# EAGLE design big-module-shift (EAGLE 6.5.0)
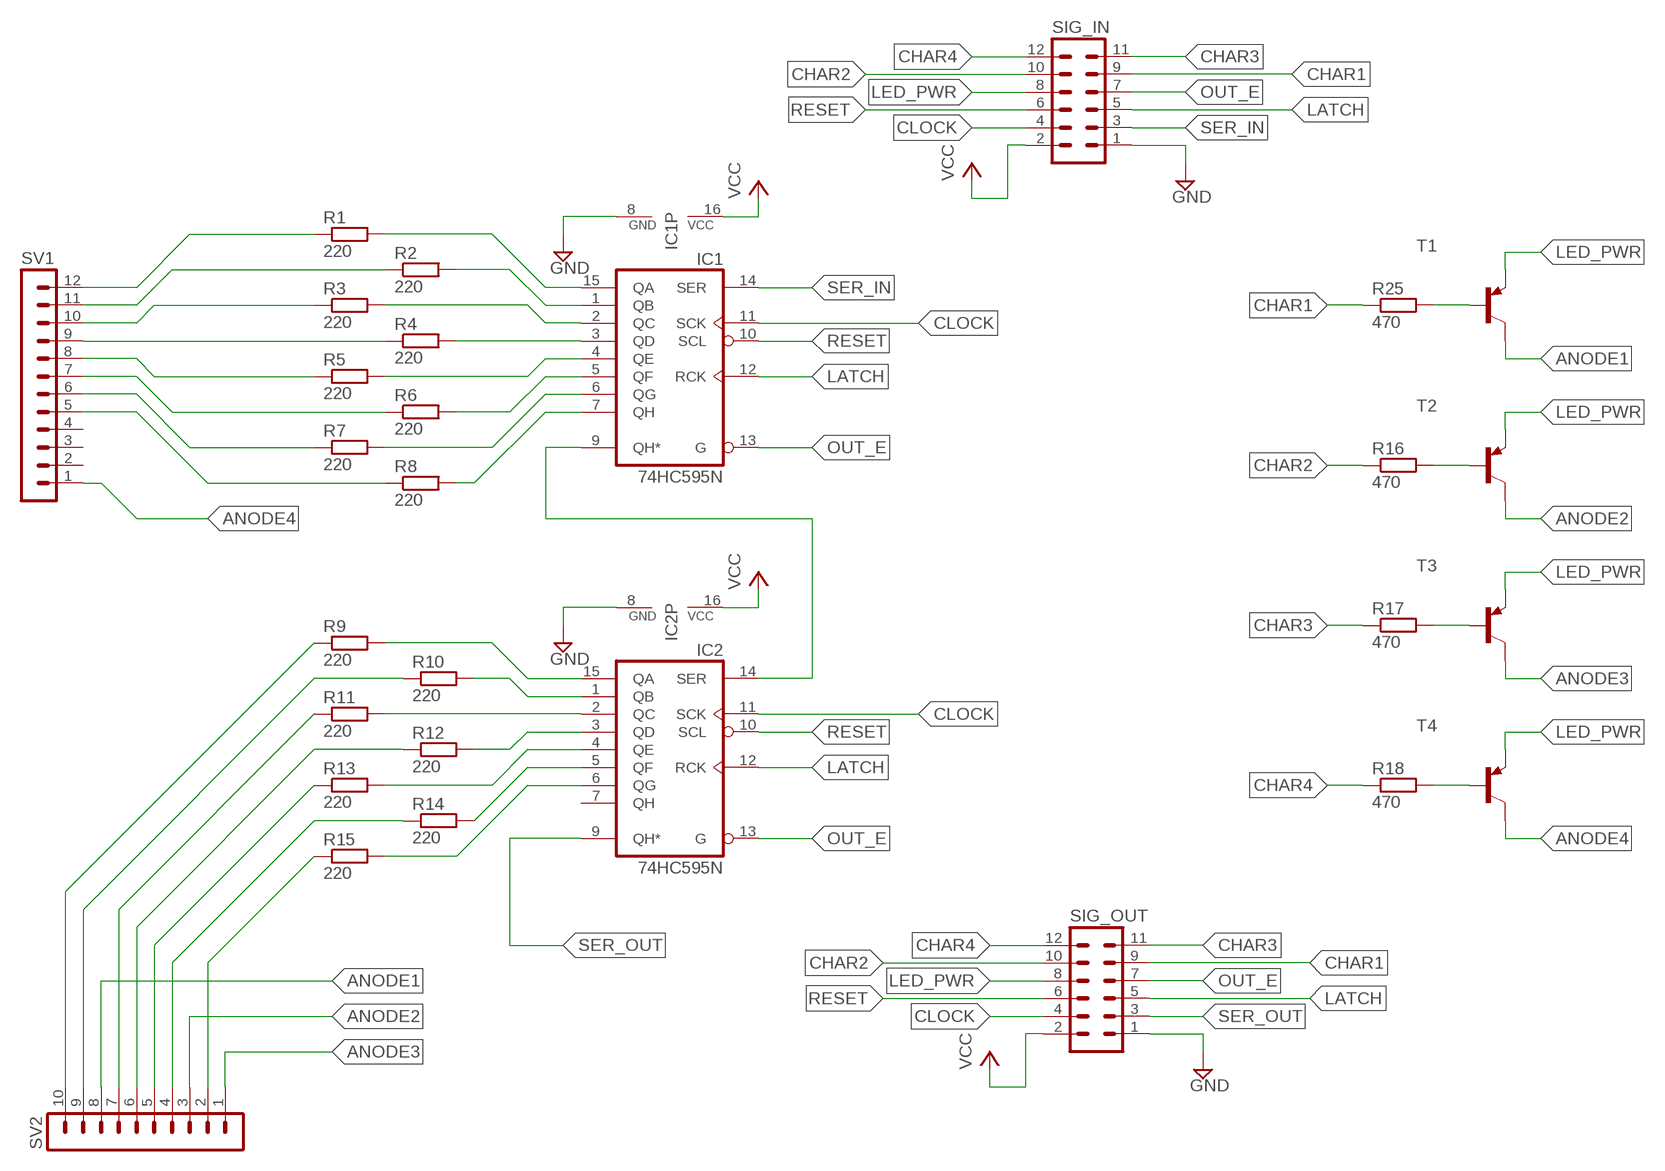
[diagram p0: schematic, sheet 1]

## Parts
IC1  74HC595N  [DIL16]
IC2  74HC595N  [DIL16]
R1  220  R-EU_M0805  [M0805]
R2  220  R-EU_M0805  [M0805]
R3  220  R-EU_M0805  [M0805]
R4  220  R-EU_M0805  [M0805]
R5  220  R-EU_M0805  [M0805]
R6  220  R-EU_M0805  [M0805]
R7  220  R-EU_M0805  [M0805]
R8  220  R-EU_M0805  [M0805]
R9  220  R-EU_M0805  [M0805]
R10  220  R-EU_M0805  [M0805]
R11  220  R-EU_M0805  [M0805]
R12  220  R-EU_M0805  [M0805]
R13  220  R-EU_M0805  [M0805]
R14  220  R-EU_M0805  [M0805]
R15  220  R-EU_M0805  [M0805]
R16  470  R-EU_R0805  [R0805]
R17  470  R-EU_R0805  [R0805]
R18  470  R-EU_R0805  [R0805]
R25  470  R-EU_R0805  [R0805]
SIG_IN  MA06-2  [MA06-2]
SIG_OUT  MA06-2  [MA06-2]
SV1  MA12-1  [MA12-1]
SV2  MA10-1  [MA10-1]
T1  BC557B-PNP-TO92-EBC  [TO92-EBC]
T2  BC557B-PNP-TO92-EBC  [TO92-EBC]
T3  BC557B-PNP-TO92-EBC  [TO92-EBC]
T4  BC557B-PNP-TO92-EBC  [TO92-EBC]

## Nets
ANODE1: SV2.8 T1.C
ANODE2: SV2.3 T2.C
ANODE3: SV2.1 T3.C
ANODE4: SV1.1 T4.C
CHAR1: R25.1 SIG_IN.9 SIG_OUT.9
CHAR2: R16.1 SIG_IN.10 SIG_OUT.10
CHAR3: R17.1 SIG_IN.11 SIG_OUT.11
CHAR4: R18.1 SIG_IN.12 SIG_OUT.12
CLOCK: IC1.11(SCK) IC2.11(SCK) SIG_IN.4 SIG_OUT.4
GND: IC1.8(GND) IC2.8(GND) SIG_IN.1 SIG_OUT.1
LATCH: IC1.12(RCK) IC2.12(RCK) SIG_IN.5 SIG_OUT.5
LED_PWR: SIG_IN.8 SIG_OUT.8 T1.E T2.E T3.E T4.E
N$1: IC1.15(QA) R1.2
N$2: IC1.1(QB) R2.2
N$3: IC1.2(QC) R3.2
N$4: IC1.3(QD) R4.2
N$5: IC1.4(QE) R5.2
N$6: IC1.5(QF) R6.2
N$7: IC1.6(QG) R7.2
N$8: IC1.7(QH) R8.2
N$9: R1.1 SV1.12
N$10: R2.1 SV1.11
N$11: R3.1 SV1.10
N$12: R4.1 SV1.9
N$13: R5.1 SV1.8
N$14: R6.1 SV1.7
N$15: R7.1 SV1.6
N$16: R8.1 SV1.5
N$17: IC1.9(QH*) IC2.14(SER)
N$18: IC2.15(QA) R9.2
N$19: IC2.1(QB) R10.2
N$20: IC2.2(QC) R11.2
N$21: IC2.3(QD) R12.2
N$22: IC2.4(QE) R13.2
N$23: IC2.5(QF) R14.2
N$24: IC2.6(QG) R15.2
N$25: R9.1 SV2.10
N$26: R10.1 SV2.9
N$27: R11.1 SV2.7
N$28: R12.1 SV2.6
N$29: R13.1 SV2.5
N$30: R14.1 SV2.4
N$31: R15.1 SV2.2
N$32: R16.2 T2.B
N$33: R17.2 T3.B
N$34: R18.2 T4.B
N$54: R25.2 T1.B
OUT_E: IC1.13(G) IC2.13(G) SIG_IN.7 SIG_OUT.7
RESET: IC1.10(SCL) IC2.10(SCL) SIG_IN.6 SIG_OUT.6
SER_IN: IC1.14(SER) SIG_IN.3
SER_OUT: IC2.9(QH*) SIG_OUT.3
VCC: IC1.16(VCC) IC2.16(VCC) SIG_IN.2 SIG_OUT.2
Unconnected: IC2.7(QH) SV1.2 SV1.3 SV1.4

## Library data of the parts
IC1 IC2 = 74xx-eu:74*595: 8-bit SHIFT REGISTER, output latch
R1-R15 = resistor:R-EU_: RESISTOR, European symbol
R16-R18 R25 = rcl:R-EU_: RESISTOR, European symbol
SIG_IN SIG_OUT = con-lstb:MA06-2: PIN HEADER; OC_FARNELL: unknown; OC_NEWARK: unknown
SV1 = con-lstb:MA12-1: PIN HEADER; OC_FARNELL: unknown; OC_NEWARK: unknown
SV2 = con-lstb:MA10-1: PIN HEADER; OC_FARNELL: unknown; OC_NEWARK: unknown
T1-T4 = transistor:*-PNP-: PNP Transistror

## Board
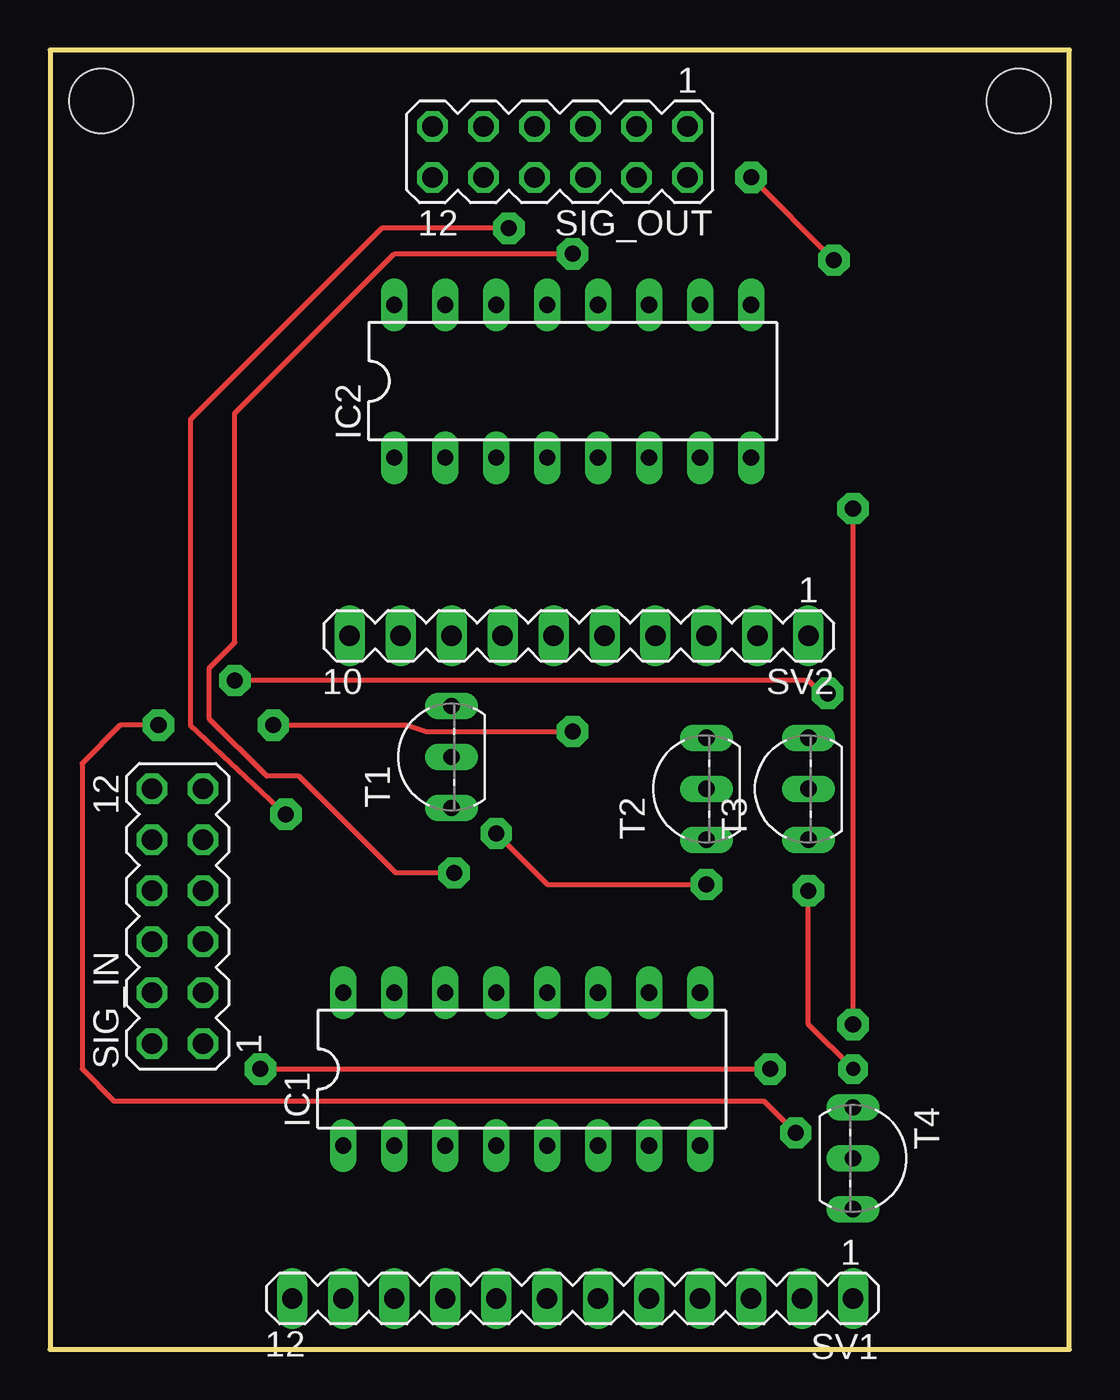
[diagram p1: board, top side]
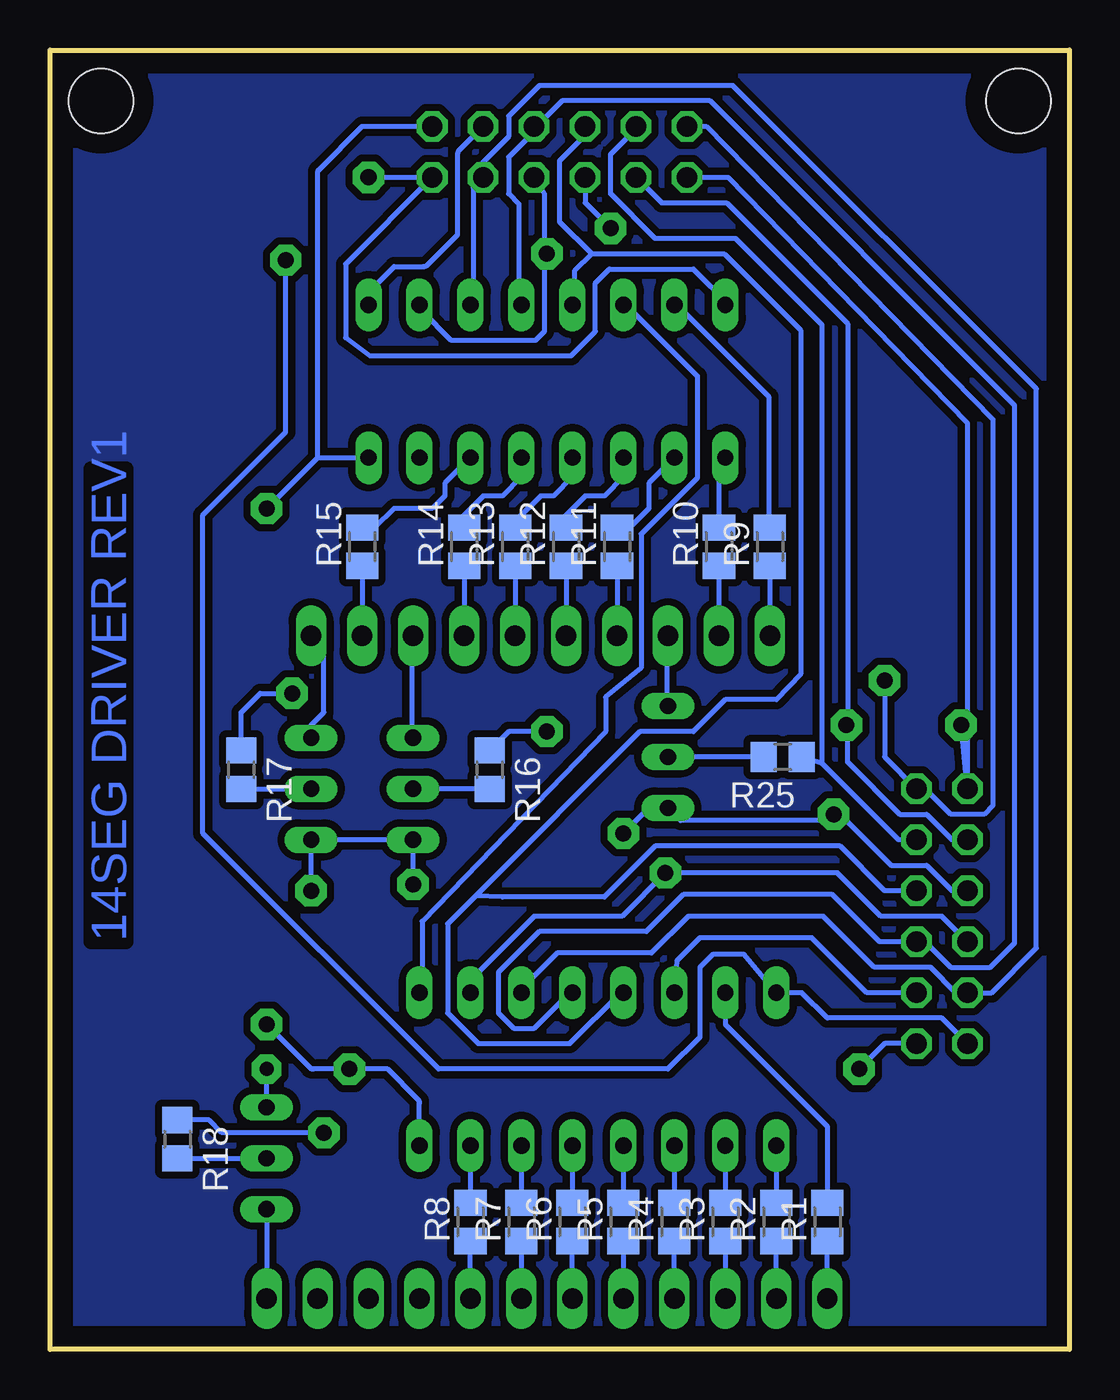
[diagram p2: board, bottom side, seen from below]

Size 50.79 x 64.76 mm. Coordinates in mm from the lower left corner, seen from the top.
Outline: 0,0 50.79,0 50.79,64.76 0,64.76 0,0
Copper layers (1*16): Top 0.035mm / dielectric 1.5mm / Bottom 0.035mm
Design rules "default *": minimum track width 10mil, minimum drill 32mil, track to track 14mil, track to pad 14mil, pad to pad 14mil, via to via 14mil, smd to smd 14mil, copper to edge 40mil, drill to drill 8mil, minimum pad ring 10mil, minimum via ring 15mil, stop-mask expansion 4mil, vias tented up to drill 0mil, thermal gap 10mil
Holes 3.2 mm at 2.54,62.23 48.26,62.23
tRestrict: area 3.8,14 to 8.9,29.2; area 17.8,57.1 to 33,62.2; area 13.3,34.3 to 38.7,36.8; area 10.8,1.3 to 41.3,3.8; area 14,16.5 to 15.2,19.1; area 16.5,16.5 to 17.8,19.1; area 19.1,16.5 to 20.3,19.1; area 21.6,16.5 to 22.9,19.1; area 24.1,16.5 to 25.4,19.1; area 26.7,16.5 to 27.9,19.1; area 29.2,16.5 to 30.5,19.1; area 31.8,16.5 to 33,19.1; 36 more areas
vRestrict: area 15.9,43.2 to 36.2,53.3; area 12.7,8.9 to 34.3,19.1; area 38.1,6.3 to 43.2,12.7; area 30.2,24.1 to 40.3,31.8; area 17.5,25.4 to 22.5,33

### Footprints (pad centres in the part's own frame; a part is rotated, then mirrored left to right if it is on the bottom)
DIL16 = drill 0.813 long: 1 -8.89,-3.81; 2 -6.35,-3.81; 3 -3.81,-3.81; 4 -1.27,-3.81; 5 1.27,-3.81; 6 3.81,-3.81; 7 6.35,-3.81; 8 8.89,-3.81; 9 8.89,3.81; 10 6.35,3.81; 11 3.81,3.81; 12 1.27,3.81; 13 -1.27,3.81; 14 -3.81,3.81; 15 -6.35,3.81; 16 -8.89,3.81
M0805 = smd 1.3 x 1.6: 1 -0.95,0; 2 0.95,0
R0805 = smd 1.3 x 1.5: 1 -0.95,0; 2 0.95,0
MA06-2 = drill 1.016 octagon: 1 -6.35,-1.27; 2 -6.35,1.27; 3 -3.81,-1.27; 4 -3.81,1.27; 5 -1.27,-1.27; 6 -1.27,1.27; 7 1.27,-1.27; 8 1.27,1.27; 9 3.81,-1.27; 10 3.81,1.27; 11 6.35,-1.27; 12 6.35,1.27
MA12-1 = drill 1.016 long: 1 -13.97,0; 2 -11.43,0; 3 -8.89,0; 4 -6.35,0; 5 -3.81,0; 6 -1.27,0; 7 1.27,0; 8 3.81,0; 9 6.35,0; 10 8.89,0; 11 11.43,0; 12 13.97,0
MA10-1 = drill 1.016 long: 1 -11.43,0; 2 -8.89,0; 3 -6.35,0; 4 -3.81,0; 5 -1.27,0; 6 1.27,0; 7 3.81,0; 8 6.35,0; 9 8.89,0; 10 11.43,0
TO92-EBC = drill 0.813 long: B 0,-1.27; C 2.54,-1.27; E -2.54,-1.27

### Placement (x,y rotation side)
IC1  23.5,13.97 0 top
IC2  26.04,48.26 0 top
R1  12.06,6.35 90 bottom
R2  14.61,6.35 90 bottom
R3  17.14,6.35 90 bottom
R4  19.68,6.35 90 bottom
R5  22.23,6.35 90 bottom
R6  24.77,6.35 90 bottom
R7  27.3,6.35 90 bottom
R8  29.84,6.35 90 bottom
R9  14.92,40.01 90 bottom
R10  17.46,40.01 90 bottom
R11  22.54,40.01 90 bottom
R12  25.08,40.01 90 bottom
R13  27.62,40.01 90 bottom
R14  30.16,40.01 90 bottom
R15  35.24,40.01 90 bottom
R16  28.89,28.89 270 bottom
R17  41.27,28.89 270 bottom
R18  44.45,10.48 270 bottom
R25  14.29,29.53 180 bottom
SIG_IN  6.35,21.59 90 top
SIG_OUT  25.4,59.69 180 top
SV1  26.04,2.54 180 top
SV2  26.35,35.56 180 top
T1  18.73,29.53 90 top
T2  31.43,27.94 90 top
T3  36.51,27.94 90 top
T4  41.27,9.53 270 top

### Tracks (layer width: path | path; a pad name or v marks a point on that pad's centre or on a via)
ANODE1
  Bottom 0.254: T1.C 20.07,31.75 20.07,35.56 SV2.8
ANODE2
  Bottom 0.254: T2.C 32.77,30.48 32.77,35.56 SV2.3
ANODE3
  Bottom 0.254: T3.C 37.78,31.11 37.15,31.75 37.15,34.92 SV2.1
ANODE4
  Bottom 0.254: T4.C SV1.1
CHAR1
  Bottom 0.254: 12.32,29.21 R25.1 | 12.32,29.21 8.51,25.4 SIG_IN.9 | SIG_OUT.9 21.59,60.83 22.86,59.56 22.86,57.59 20.64,55.37 16.64,55.37 12.32,51.05 12.32,29.21
CHAR2  (via drill 0.8 pad 1.27)
  Top 0.254: v11.11,31.11 17.78,31.11 18.73,30.8 v26.04,30.8
  Bottom 0.254: SIG_IN.10 5.84,25.4 7.11,26.67 8.45,26.67 11.05,29.27 11.05,31.05 | 11.05,31.05 11.05,51.12 17.08,57.15 20.32,57.15 SIG_OUT.10 | 11.05,31.05 v11.11,31.11 | v26.04,30.8 27.94,30.8 R16.1
CHAR3  (via drill 0.8 pad 1.27)
  Top 0.254: v38.73,32.7 38.42,32.7 37.78,33.34 v9.21,33.34
  Bottom 0.254: SIG_OUT.11 18.1,60.96 3.81,46.35 3.81,27.11 4.25,26.67 5.91,26.67 7.18,27.94 SIG_IN.11 9.21,29.53 v9.21,33.34 | R17.1 41.27,31.75 40.32,32.7 v38.73,32.7
CHAR4  (via drill 0.8 pad 1.27)
  Top 0.254: v5.4,31.11 3.49,31.11 1.59,29.21 1.59,13.97 3.17,12.38 35.56,12.38 v37.15,10.79
  Bottom 0.254: SIG_OUT.12 17.02,58.42 5.08,46.16 SIG_IN.12 v5.4,31.11 | v37.15,10.79 42.23,10.79 42.86,11.43 R18.1
CLOCK
  Bottom 0.254: IC2.11 29.72,52.07 29.72,57.91 SIG_OUT.4 29.21,59.18 27.94,60.45 27.94,61.47 26.42,62.99 16.76,62.99 1.65,47.88 1.65,20 3.87,17.78 SIG_IN.4 5.65,17.78 6.92,19.05 9.72,19.05 12.26,21.59 18.99,21.59 20.83,19.75 25.53,19.75 27.81,17.46 IC1.11
GND  (via drill 0.8 pad 1.27)
  Top 0.254: v40.01,16.19 v40.01,41.91 | v10.48,13.97 v35.88,13.97
  Bottom 0.254: IC1.8 32.38,12.28 arc-45 32.46,12.46 33.97,13.97 v35.88,13.97 36.2,13.97 37.68,13.97 arc45 37.86,14.04 v40.01,16.19 | v40.01,41.91 37.47,44.45 | 37.47,44.45 IC2.8 | 37.47,44.45 37.47,58.63 arc45 37.39,58.81 35.24,60.96 SIG_OUT.1 | SIG_IN.1 9.21,15.24 v10.48,13.97
LATCH
  Bottom 0.254: IC2.12 27.43,52.07 27.43,57.09 27.94,57.59 27.94,59.44 26.67,60.71 SIG_OUT.5 26.54,60.96 25.27,62.23 17.91,62.23 2.73,47.05 2.73,20.26 3.94,19.05 5.91,19.05 7.18,20.32 SIG_IN.5 9.46,20.32 11.81,22.67 19.24,22.67 21.08,20.83 26.42,20.83 28.45,18.8 28.45,16.76 27.69,16 26.67,16 24.89,17.78 IC1.12
LED_PWR  (via drill 0.7 pad 1.27, 0.8 pad 1.27)
  Top 0.254: v40.01,13.97 37.78,16.19 v37.78,22.86 | v22.23,25.72 24.77,23.18 v32.7,23.18 | v22.86,55.88 16.51,55.88 6.99,46.35 6.99,31.11 v11.75,26.67
  Bottom 0.254: T4.E v40.01,13.97 | v37.78,22.86 T3.E T2.E v32.7,23.18 | SIG_IN.8 5.84,22.86 7.11,24.13 8.89,24.13 11.11,26.35 12.38,26.35 | SIG_OUT.8 24.13,57.15 v22.86,55.88 | v11.75,26.67 12.38,26.35 | 12.38,26.35 19.37,26.35 T1.E 20.95,26.99 v22.23,25.72
N$1
  Bottom 0.254: IC1.15 17.14,16.19 12.06,11.11 R1.2
N$2
  Bottom 0.254: IC1.1 R2.2
N$3
  Bottom 0.254: IC1.2 R3.2
N$4
  Bottom 0.254: IC1.3 R4.2
N$5
  Bottom 0.254: IC1.4 R5.2
N$6
  Bottom 0.254: IC1.5 R6.2
N$7
  Bottom 0.254: IC1.6 R7.2
N$8
  Bottom 0.254: IC1.7 R8.2
N$9
  Bottom 0.254: SV1.12 R1.1
N$10
  Bottom 0.254: SV1.11 R2.1
N$11
  Bottom 0.254: R3.1 SV1.10
N$12
  Bottom 0.254: SV1.9 R4.1
N$13
  Bottom 0.254: R5.1 SV1.8
N$14
  Bottom 0.254: SV1.7 R6.1
N$15
  Bottom 0.254: R7.1 SV1.6
N$16
  Bottom 0.254: SV1.5 R8.1
N$17
  Bottom 0.254: IC1.9 32.26,17.78 32.26,21.34 23.11,30.8 23.11,32.51 21.34,33.97 21.34,40.64 18.54,43.43 18.54,48.51 22.1,52.07 IC2.14
N$18
  Bottom 0.254: R9.2 14.99,41.15 14.99,47.5 19.56,52.07 IC2.15
N$19
  Bottom 0.254: IC2.1 17.46,44.13 R10.2
N$20
  Bottom 0.254: IC2.2 20.95,43.18 20.95,41.91 21.91,40.95 R11.2
N$21
  Bottom 0.254: IC2.3 22.23,43.49 23.18,42.55 24.13,42.55 25.08,41.59 R12.2
N$22
  Bottom 0.254: IC2.4 24.77,43.5 25.72,42.55 26.35,42.55 27.62,41.27 R13.2
N$23
  Bottom 0.254: IC2.5 27.3,43.49 28.25,42.55 29.21,42.55 30.16,41.59 R14.2
N$24
  Bottom 0.254: IC2.6 31.11,43.18 31.11,42.55 31.75,41.91 33.66,41.91 34.61,40.95 R15.2
N$25
  Bottom 0.254: R9.1 SV2.10
N$26
  Bottom 0.254: R10.1 SV2.9
N$27
  Bottom 0.254: R11.1 SV2.7
N$28
  Bottom 0.254: R12.1 SV2.6
N$29
  Bottom 0.254: R13.1 SV2.5
N$30
  Bottom 0.254: R14.1 SV2.4
N$31
  Bottom 0.254: R15.1 SV2.2
N$32
  Bottom 0.254: R16.2 T2.B
N$33
  Bottom 0.254: R17.2 T3.B
N$34
  Bottom 0.254: R18.2 T4.B
N$35
  pour Bottom: 0,64.77 50.8,64.77 50.8,0 0,0
N$54
  Bottom 0.254: R25.2 T1.B
OUT_E
  Bottom 0.254: 29.59,22.61 21.4,30.8 18.73,30.8 17.14,32.38 14.61,32.38 13.4,33.66 13.4,50.8 17.21,54.61 23.81,54.61 | 29.59,22.61 30.99,21.21 30.99,16.76 29.46,15.24 24.89,15.24 22.35,17.78 IC1.13 | 23.81,54.61 24.64,53.78 24.64,52.07 IC2.13 | SIG_OUT.7 24.13,60.52 25.4,59.24 25.4,56.2 23.81,54.61 | SIG_IN.7 9.21,22.86 11.43,25.08 20.64,25.08 23.18,22.54 28.26,22.54 29.59,22.61
RESET  (via drill 0.8 pad 1.27)
  Top 0.254: v20.13,23.75 17.21,23.75 12.38,28.57 10.79,28.57 7.94,31.43 7.94,33.97 9.21,35.24 9.21,46.67 17.14,54.61 v26.04,54.61
  Bottom 0.254: 26.16,54.61 26.16,57.59 SIG_OUT.6 | 26.16,54.61 26.16,50.74 26.61,50.29 30.8,50.29 32.26,51.75 IC2.10 | SIG_IN.6 6.35,21.59 9.4,21.59 11.56,23.75 v20.13,23.75 22.29,21.59 26.67,21.59 29.72,18.54 29.72,17.78 IC1.10 | v26.04,54.61 26.16,54.61
SER_IN
  Bottom 0.254: SIG_IN.3 10.1,17.78 12.83,20.51 18.41,20.51 19.56,19.37 IC1.14
SER_OUT
  Bottom 0.254: IC2.9 34.92,52.6 arc45 34.85,52.78 33.66,53.98 32.17,53.98 arc-45 31.99,54.05 30.48,55.56 30.48,59.59 arc45 30.41,59.76 SIG_OUT.3
VCC  (via drill 0.8 pad 1.27)
  Top 0.254: v39.05,54.29 v34.92,58.42
  Bottom 0.254: SIG_IN.2 6.35,16.51 12.06,16.51 13.34,17.78 IC1.16 16.19,19.68 17.78,19.68 18.41,19.05 18.41,15.56 20,13.97 31.43,13.97 43.18,25.72 43.18,41.59 39.05,45.72 v39.05,54.29 | IC2.16 16.95,52.07 18.73,53.85 22.92,53.85 23.62,53.15 23.62,50.74 24.83,49.53 34.86,49.53 36.07,50.42 36.07,54.1 SIG_OUT.2 v34.92,58.42

### Text on the board
Bottom: 14SEG DRIVER REV1